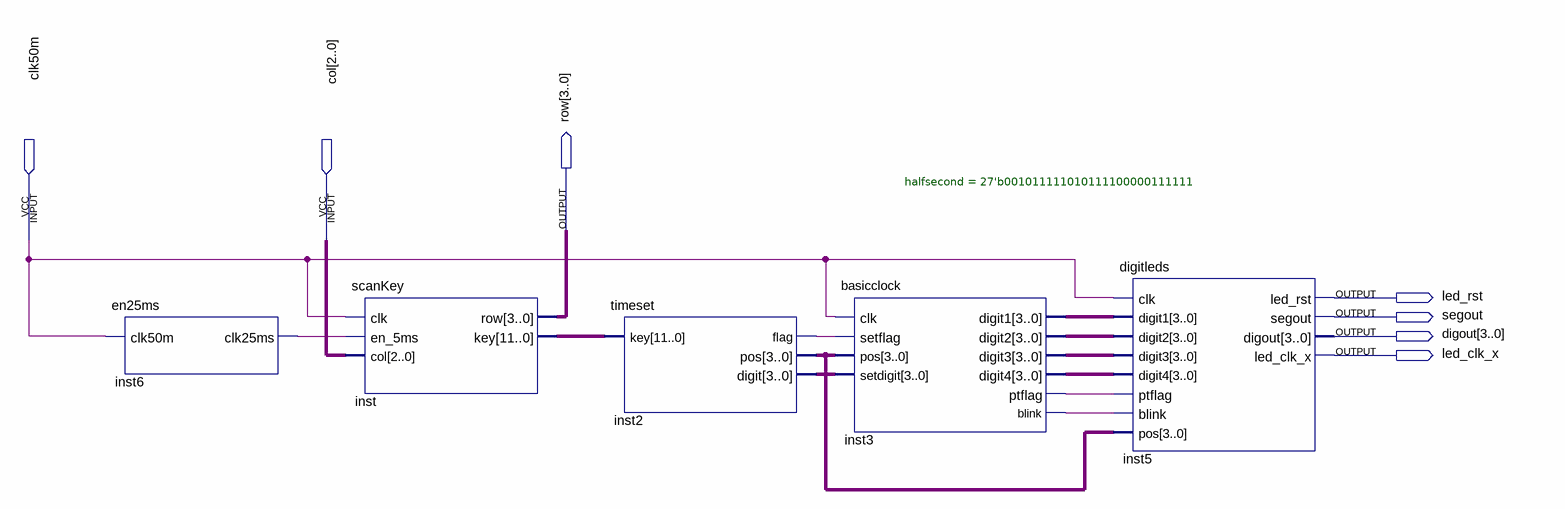
[diagram p0: schematic sheet]
// Quartus schematic realclock.bdf as structural Verilog: 5 symbols, 7 pins
module realclock (
  input  clk50m,
  input  [2:0] col,
  output [3:0] row,
  output led_rst,
  output segout,
  output [3:0] digout,
  output led_clk_x
);

  wire inst2_flag, inst3_blink, inst3_ptflag, inst6_clk25ms;
  wire [3:0] inst2_digit, inst2_pos, inst3_digit1, inst3_digit2, inst3_digit3, inst3_digit4;
  wire [11:0] inst_key;

  en25ms inst6 (.clk50m(clk50m), .clk25ms(inst6_clk25ms));
  scanKey inst (.clk(clk50m), .en_5ms(inst6_clk25ms), .col(col), .row(row), .key(inst_key));
  timeset inst2 (.key(inst_key), .flag(inst2_flag), .pos(inst2_pos), .digit(inst2_digit));
  basicclock #(.halfsecond(27'b001011111010111100000111111)) inst3 (
    .clk(clk50m), .setflag(inst2_flag), .pos(inst2_pos), .setdigit(inst2_digit), .digit1(inst3_digit1),
    .digit2(inst3_digit2), .digit3(inst3_digit3), .digit4(inst3_digit4), .ptflag(inst3_ptflag),
    .blink(inst3_blink));
  digitleds inst5 (
    .clk(clk50m), .digit1(inst3_digit1), .digit2(inst3_digit2), .digit3(inst3_digit3), .digit4(inst3_digit4),
    .ptflag(inst3_ptflag), .blink(inst3_blink), .pos(inst2_pos), .led_rst(led_rst), .segout(segout),
    .digout(digout), .led_clk_x(led_clk_x));
endmodule
